# EAGLE design power_dist (EAGLE 9.6.0)
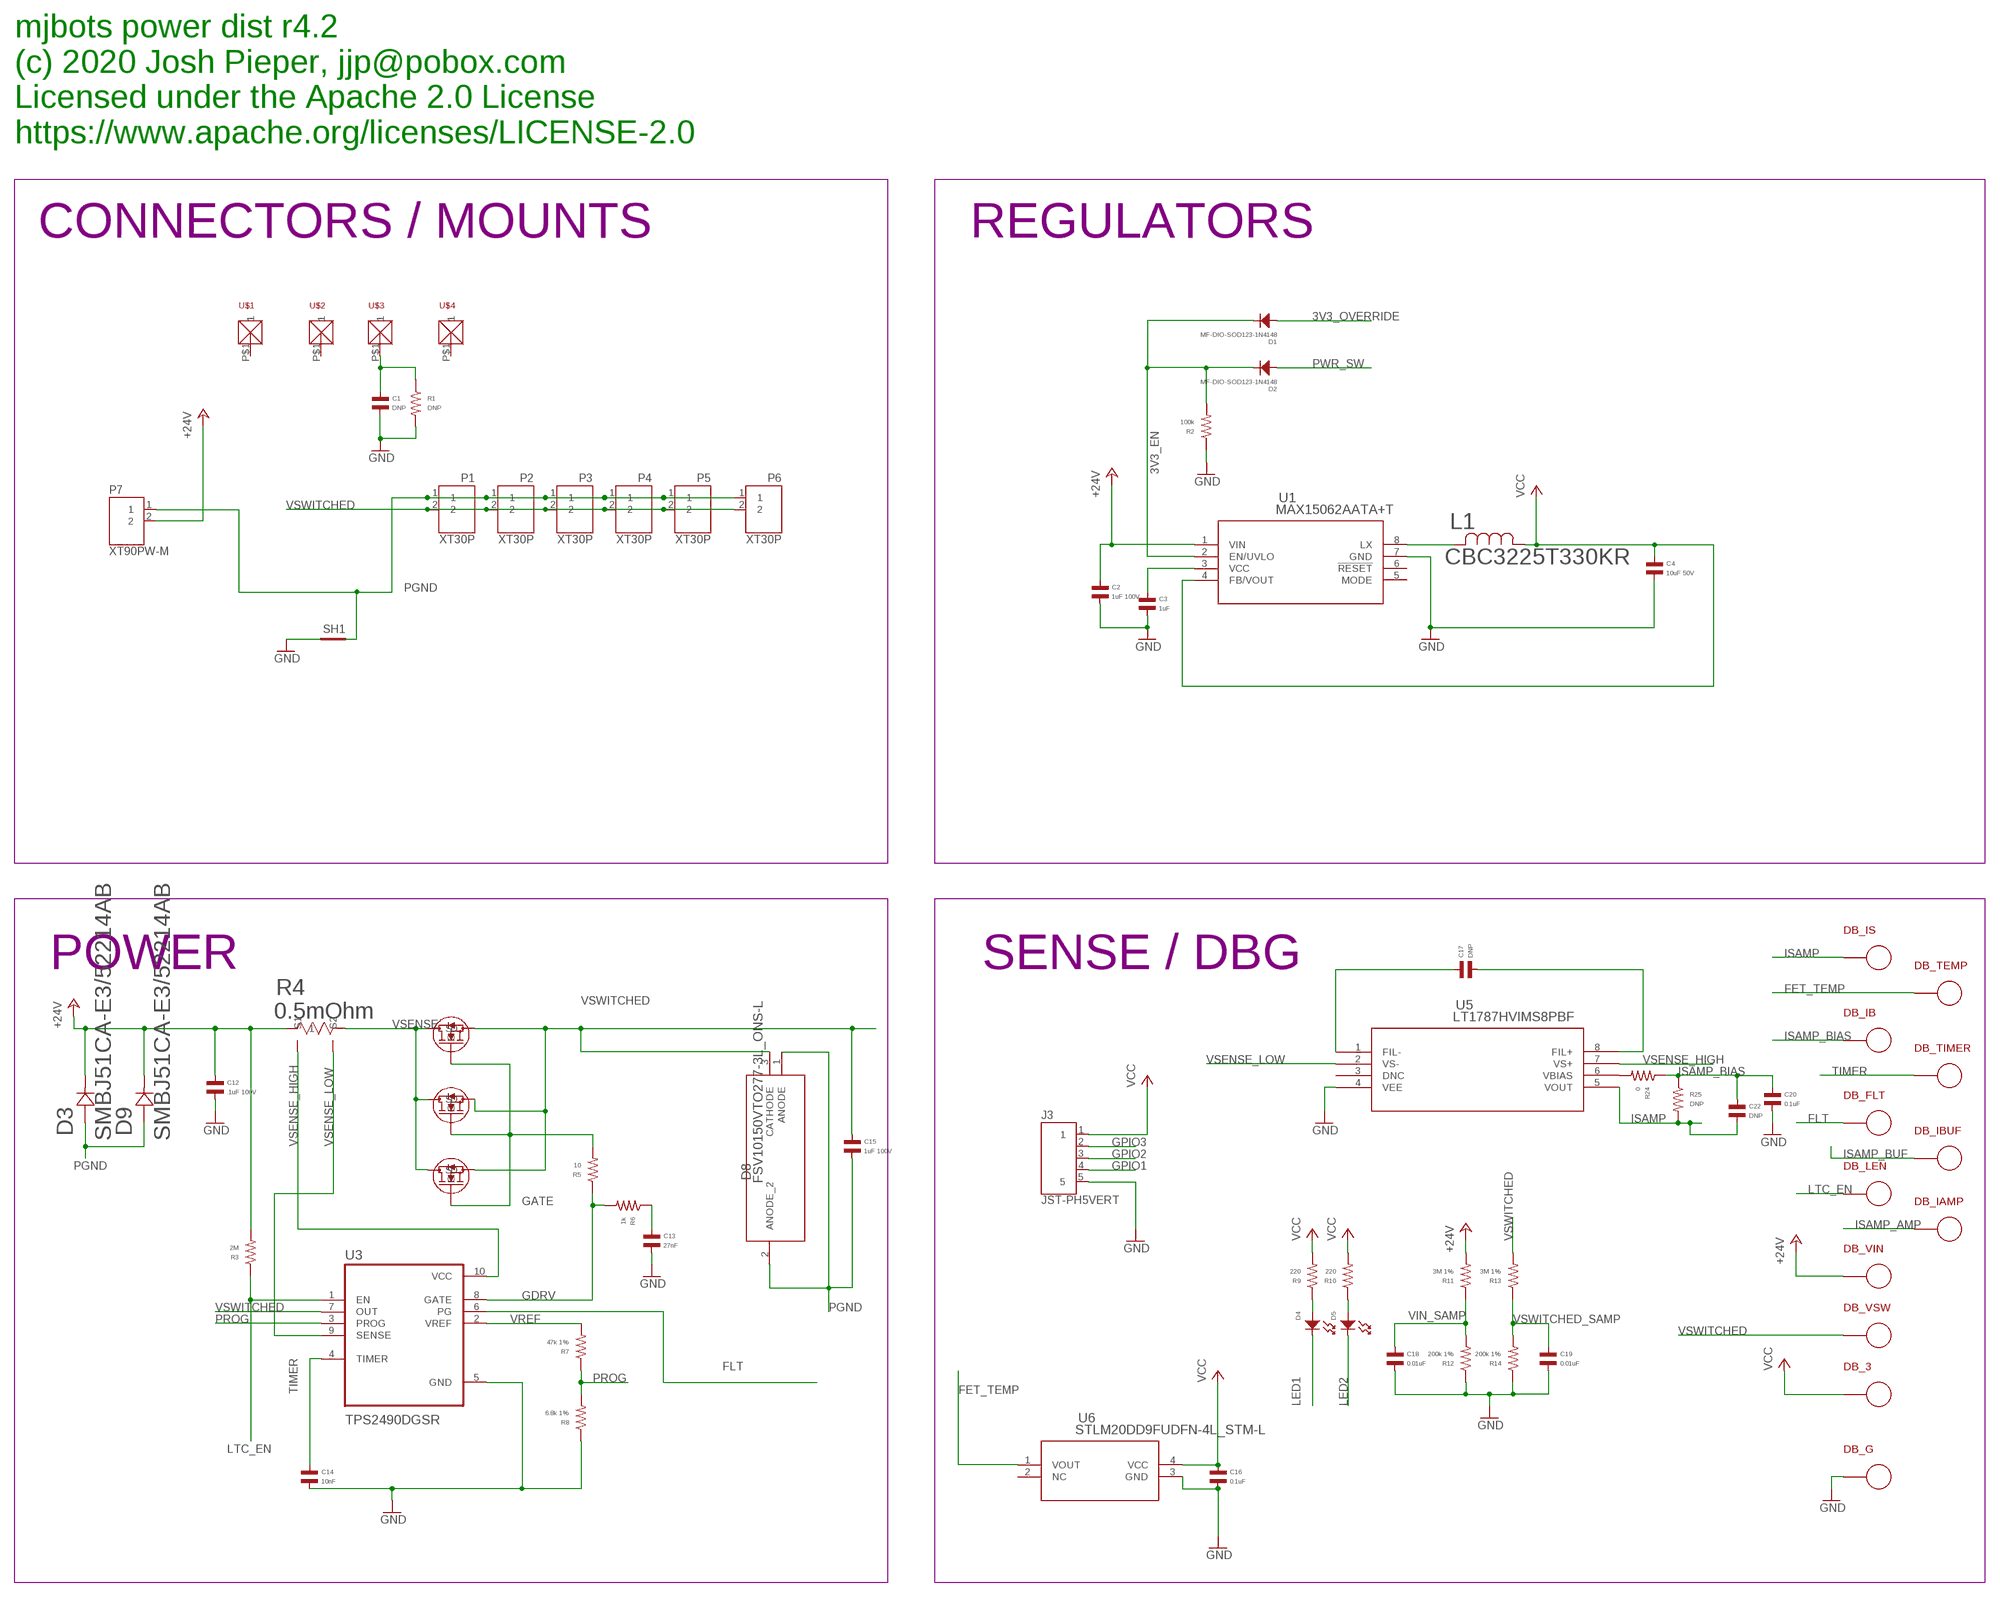
[diagram p0: schematic, sheet 1, part 1 of 2]
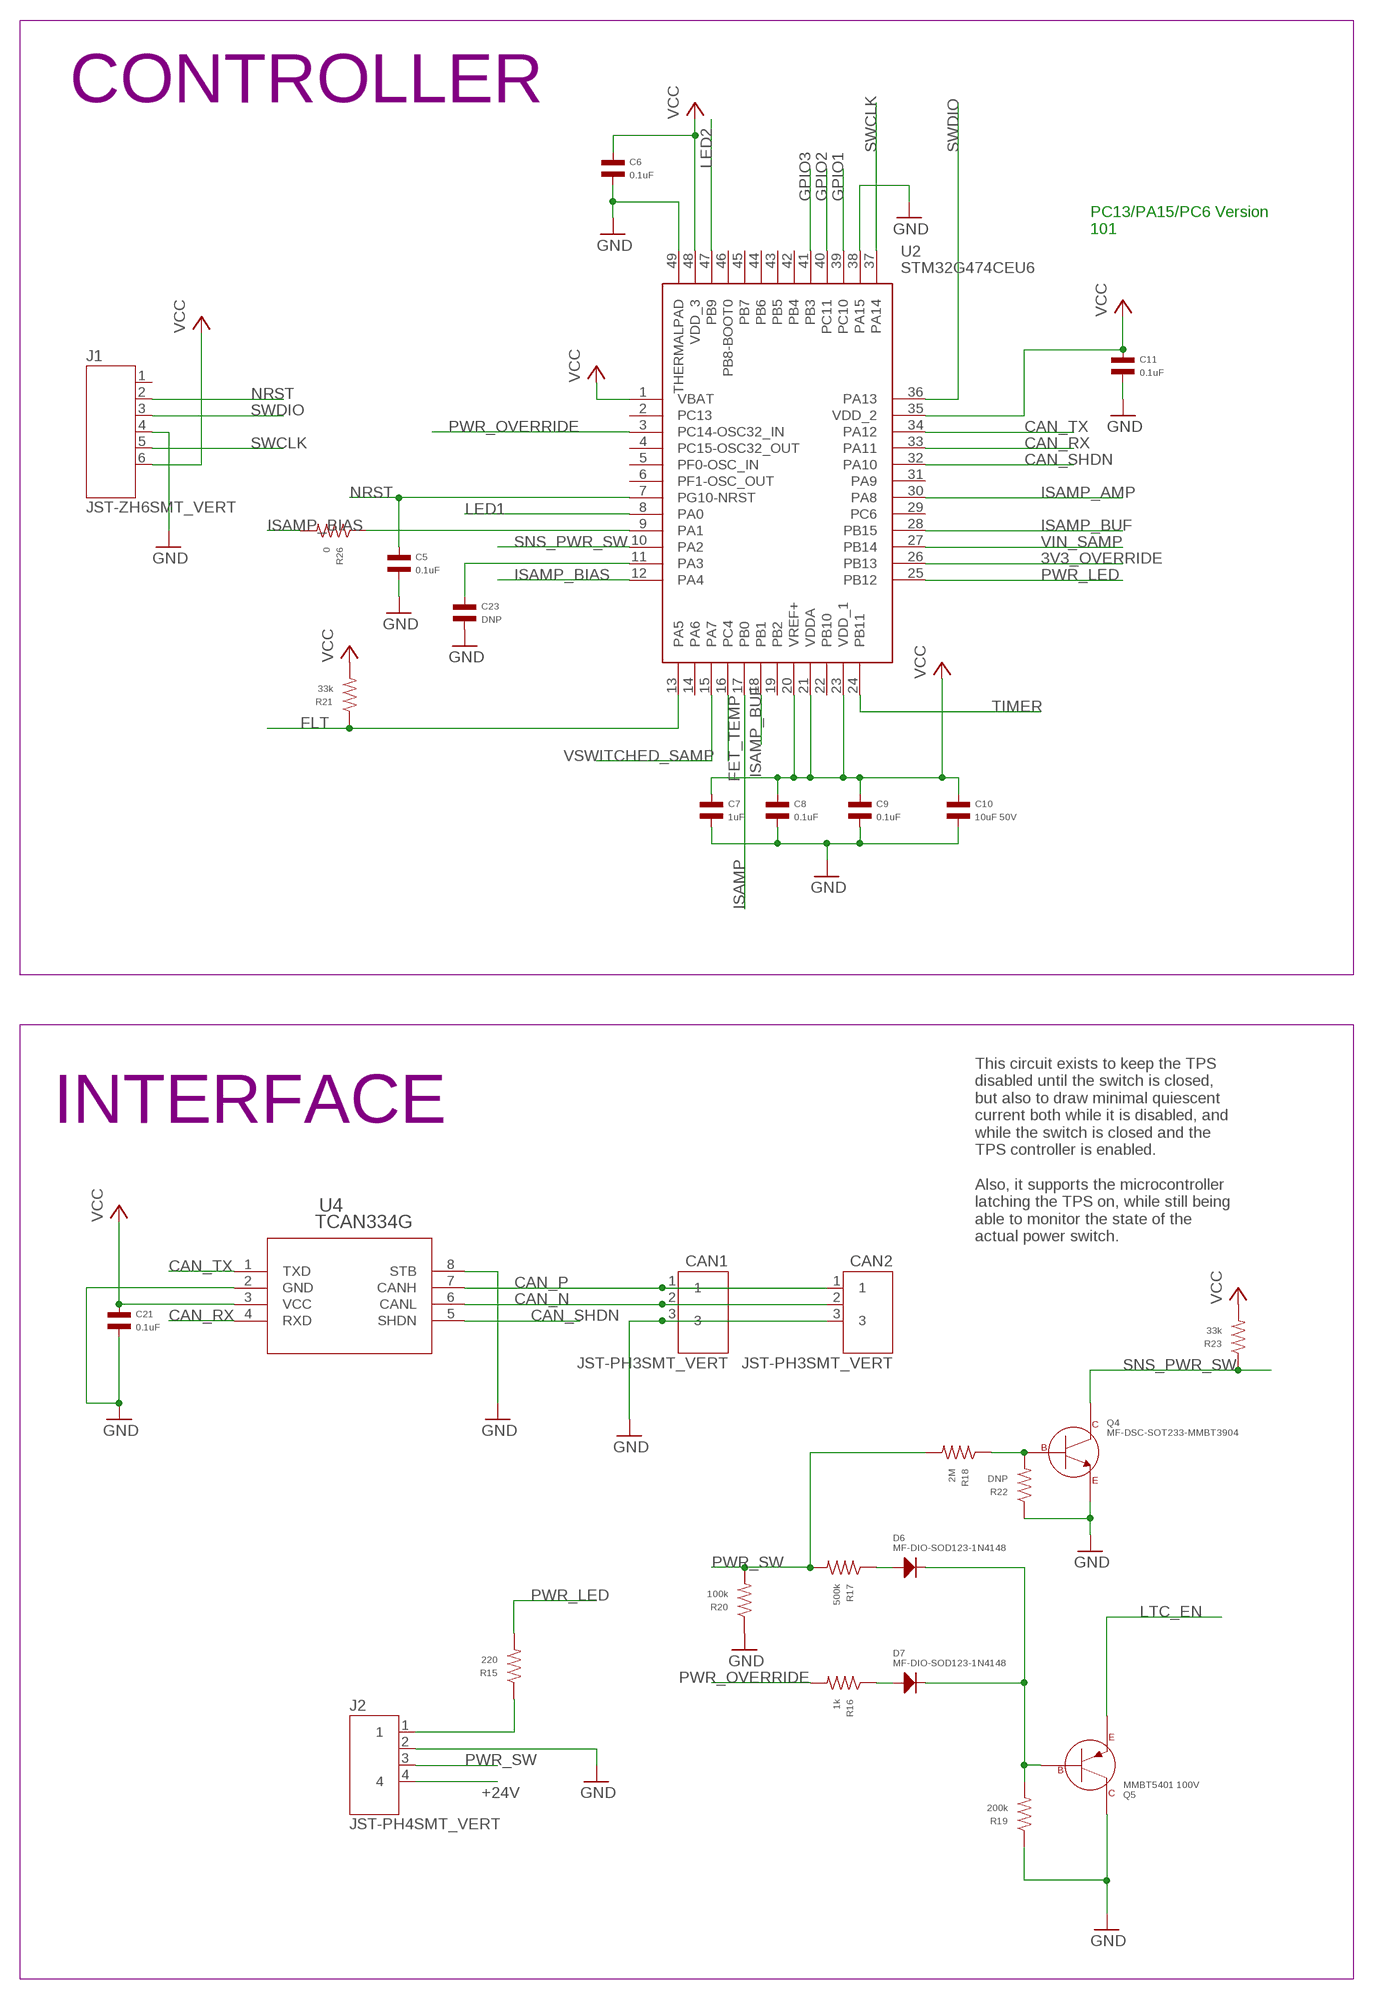
[diagram p1: schematic, sheet 1, part 2 of 2]

## Parts
C1  DNP  CAPACITOR_NP_0603  [C0603]
C2  1uF 100V  CAPACITOR_NP_0805  [C0805]
C3  1uF  CAPACITOR_NP_0603  [C0603]
C4  10uF 50V  CAPACITOR_NP_1206  [C1206]
C5  0.1uF  CAPACITOR_NP_0603  [C0603]
C6  0.1uF  CAPACITOR_NP_0603  [C0603]
C7  1uF  CAPACITOR_NP_0603  [C0603]
C8  0.1uF  CAPACITOR_NP_0603  [C0603]
C9  0.1uF  CAPACITOR_NP_0603  [C0603]
C10  10uF 50V  CAPACITOR_NP_1206  [C1206]
C11  0.1uF  CAPACITOR_NP_0603  [C0603]
C12  .1uF 100V  CAPACITOR_NP_0603  [C0603]
C13  27nF  CAPACITOR_NP_0603  [C0603]
C14  10nF  CAPACITOR_NP_0603  [C0603]
C15  1uF 100V  CAPACITOR_NP_0805  [C0805]
C16  0.1uF  CAPACITOR_NP_0603  [C0603]
C17  DNP  CAPACITOR_NP_0603  [C0603]
C18  0.01uF  CAPACITOR_NP_0603  [C0603]
C19  0.01uF  CAPACITOR_NP_0603  [C0603]
C20  0.1uF  CAPACITOR_NP_0603  [C0603]
C21  0.1uF  CAPACITOR_NP_0603  [C0603]
C22  DNP  CAPACITOR_NP_0603  [C0603]
C23  DNP  CAPACITOR_NP_0603  [C0603]
CAN1  JST-PH3SMT_VERT  [JST_B3B_PH-SM4-TB(LF)(SN)]
CAN2  JST-PH3SMT_VERT  [JST_B3B_PH-SM4-TB(LF)(SN)]
D1  MF-DIO-SOD123-1N4148  DIODES_1N4148_SOD-123  [SOD-123]
D2  MF-DIO-SOD123-1N4148  DIODES_1N4148_SOD-123  [SOD-123]
D3  SMBJ51CA-E3/52214AB  [DIODE_DO-214AB]
D4  LED_SINGLE-0603  [LED0603]
D5  LED_SINGLE-0603  [LED0603]
D6  MF-DIO-SOD123-1N4148  DIODES_1N4148_SOD-123  [SOD-123]
D7  MF-DIO-SOD123-1N4148  DIODES_1N4148_SOD-123  [SOD-123]
D8  FSV10150VTO277-3L_ONS-L  [TO277-3L_ONS-L]
D9  SMBJ51CA-E3/52214AB  [DIODE_DO-214AB]
DB_3  PAD24AWG_PAD  [24AWG_PAD]
DB_FLT  PAD24AWG_PAD  [24AWG_PAD]
DB_G  PAD24AWG_PAD  [24AWG_PAD]
DB_IAMP  PAD24AWG_PAD  [24AWG_PAD]
DB_IB  PAD24AWG_PAD  [24AWG_PAD]
DB_IBUF  PAD24AWG_PAD  [24AWG_PAD]
DB_IS  PAD24AWG_PAD  [24AWG_PAD]
DB_LEN  PAD24AWG_PAD  [24AWG_PAD]
DB_TEMP  PAD24AWG_PAD  [24AWG_PAD]
DB_TIMER  PAD24AWG_PAD  [24AWG_PAD]
DB_VIN  PAD24AWG_PAD  [24AWG_PAD]
DB_VSW  PAD24AWG_PAD  [24AWG_PAD]
J1  JST-ZH6SMT_VERT  [JST_B6B-ZR-SM4-TF(LF)(SN)]
J2  JST-PH4SMT_VERT  [JST_B4B_PH-SM4-TB(LF)(SN)]
J3  JST-PH5VERT  [JST_B5B_PH-SM4-TB(LF)(SN)]
L1  CBC3225T330KR  [IND_TAIYO_CBC3225_TAY]
P1  XT30P  [XT30P]
P2  XT30P  [XT30P]
P3  XT30P  [XT30P]
P4  XT30P  [XT30P]
P5  XT30P  [XT30P]
P6  XT30P  [XT30P]
P7  XT90PW-M  [XT90PW-M]
Q1  PSMN4R8-100BSEJ  [D2PAK_SOT404_NEX]
Q2  PSMN4R8-100BSEJ  [D2PAK_SOT404_NEX]
Q3  PSMN4R8-100BSEJ  [D2PAK_SOT404_NEX]
Q4  MF-DSC-SOT233-MMBT3904  NPN_BJTMMBT3904_SOT-23-3  [SOT-23-3]
Q5  MMBT5401 100V  PNP_BJT_MMBT3906_SOT-23-3  [SOT-23-3]
R1  DNP  RESISTOR_0603  [R0603]
R2  100k  RESISTOR_0603  [R0603]
R3  2M  RESISTOR_0603  [R0603]
R4  0.5mOhm  SENSE_RESISTOR2512  [SHUNT2512]
R5  10  RESISTOR_0603  [R0603]
R6  1k  RESISTOR_0603  [R0603]
R7  47k 1%  RESISTOR_0603  [R0603]
R8  6.8k 1%  RESISTOR_0603  [R0603]
R9  220  RESISTOR_0603  [R0603]
R10  220  RESISTOR_0603  [R0603]
R11  3M 1%  RESISTOR_0603  [R0603]
R12  200k 1%  RESISTOR_0603  [R0603]
R13  3M 1%  RESISTOR_0603  [R0603]
R14  200k 1%  RESISTOR_0603  [R0603]
R15  220  RESISTOR_0603  [R0603]
R16  1k  RESISTOR_0603  [R0603]
R17  500k  RESISTOR_0603  [R0603]
R18  2M  RESISTOR_0603  [R0603]
R19  200k  RESISTOR_0603  [R0603]
R20  100k  RESISTOR_0603  [R0603]
R21  33k  RESISTOR_0603  [R0603]
R22  DNP  RESISTOR_0603  [R0603]
R23  33k  RESISTOR_0603  [R0603]
R24  0  RESISTOR_0603  [R0603]
R25  DNP  RESISTOR_0603  [R0603]
R26  0  RESISTOR_0603  [R0603]
SH1  SHORTBIG  [SHORT_TOP-BIG]
U1  MAX15062AATA+T  [21-0487A_MXM]
U2  STM32G474CEU6  [QFN50P700X700X60-49N]
U3  TPS2490DGSR  [SOP50P490X110-10N]
U4  TCAN334G  [SOIC8]
U5  LT1787HVIMS8PBF  [MSOP-8_MS]
U6  STLM20DD9FUDFN-4L_STM-L  [UDFN-4L_STM-L]
U$1  MOUNT  [M2.5MOUNT]
U$2  MOUNT  [M2.5MOUNT]
U$3  MOUNT  [M2.5MOUNT]
U$4  MOUNT  [M2.5MOUNT]

## Nets
3V3_EN: D1.CATHODE D2.CATHODE R2.P$2 U1.2(EN/UVLO)
3V3_OVERRIDE: D1.ANODE U2.26(PB13)
+24V: C2.P$1 C12.P$1 D3.P$1 D9.P$1 DB_VIN.P$1 J2.4 P7.2 R3.P$2 R4.1 R11.P$2 U1.1(VIN)
CAN_N: CAN1.2 CAN2.2 U4.6(CANL)
CAN_P: CAN1.1 CAN2.1 U4.7(CANH)
CAN_RX: U2.33(PA11) U4.4(RXD)
CAN_SHDN: U2.32(PA10) U4.5(SHDN)
CAN_TX: U2.34(PA12) U4.1(TXD)
FET_TEMP: DB_TEMP.P$1 U2.16(PC4) U6.1(VOUT)
FLT: DB_FLT.P$1 R21.P$1 U2.13(PA5) U3.6(PG)
GATE: Q1.1(G) Q2.1(G) Q3.1(G) R5.P$2
GDRV: R5.P$1 R6.P$2 U3.8(GATE)
GND: C1.P$2 C2.P$2 C3.P$2 C4.P$2 C5.P$2 C6.P$2 C7.P$2 C8.P$2 C9.P$2 C10.P$2 C11.P$2 C12.P$2 C13.P$2 C14.P$2 C16.P$2 C18.P$2 C19.P$2 C20.P$2 C21.P$2 C23.P$2 CAN1.3 CAN2.3 DB_G.P$1 J1.4 J2.2 J3.5 Q4.P$2(EMITTER) Q5.P$3(COLLECTOR) R1.P$2 R2.P$1 R8.P$1 R12.P$1 R14.P$1 R19.P$1 R20.P$1 R22.P$1 SH1.1 U1.7(GND) U2.38(PA15) U2.49(THERMALPAD) U3.5(GND) U4.2(GND) U4.8(STB) U5.4(VEE) U6.3(GND)
GPIO1: J3.4 U2.39(PC10)
GPIO2: J3.3 U2.40(PC11)
GPIO3: J3.2 U2.41(PB3)
ISAMP: C22.P$2 DB_IS.P$1 R25.P$2 U2.17(PB0) U5.5(VOUT)
ISAMP_AMP: DB_IAMP.P$1 U2.30(PA8)
ISAMP_BIAS: C20.P$1 C22.P$1 DB_IB.P$1 R24.P$1 R25.P$1 R26.P$2 U2.12(PA4)
ISAMP_BUF: DB_IBUF.P$1 U2.18(PB1) U2.28(PB15)
LED1: D4.CATHODE U2.8(PA0)
LED2: D5.CATHODE U2.47(PB9)
LTC_EN: DB_LEN.P$1 Q5.P$2(EMITTER) R3.P$1 U3.1(EN)
N$1: L1.2 U1.8(LX)
N$2: J2.1 R15.P$1
N$3: R24.P$2 U5.6(VBIAS)
N$4: C3.P$1 U1.3(VCC)
N$5: C23.P$1 U2.11(PA3)
N$6: C17.P$1 U5.1(FIL-)
N$7: C17.P$2 U5.8(FIL+)
N$8: D4.ANODE R9.P$1
N$9: C13.P$1 R6.P$1
N$10: R26.P$1 U2.9(PA1)
N$11: Q4.P$1(BASE) R18.P$1 R22.P$2
N$13: D6.CATHODE D7.CATHODE Q5.P$1(BASE) R19.P$2
N$14: D5.ANODE R10.P$1
N$15: C1.P$1 R1.P$1 U$3.P$1
N$17: D6.ANODE R17.P$1
N$18: D7.ANODE R16.P$1
NRST: C5.P$1 J1.2 U2.7(PG10-NRST)
PGND: C15.P$2 D3.P$2 D8.1(ANODE) D8.2(ANODE_2) D9.P$2 P1.1 P2.1 P3.1 P4.1 P5.1 P6.1 P7.1 SH1.2
PROG: R7.P$1 R8.P$2 U3.3(PROG)
PWR_LED: R15.P$2 U2.25(PB12)
PWR_OVERRIDE: R16.P$2 U2.3(PC14-OSC32_IN)
PWR_SW: D2.ANODE J2.3 R17.P$2 R18.P$2 R20.P$2
SNS_PWR_SW: Q4.P$3(COLLECTOR) R23.P$1 U2.10(PA2)
SWCLK: J1.5 U2.37(PA14)
SWDIO: J1.3 U2.36(PA13)
TIMER: C14.P$1 DB_TIMER.P$1 U2.24(PB11) U3.4(TIMER)
VCC [power]: C4.P$1 C6.P$1 C7.P$1 C8.P$1 C9.P$1 C10.P$1 C11.P$1 C16.P$1 C21.P$1 DB_3.P$1 J1.6 J3.1 L1.1 R9.P$2 R10.P$2 R21.P$2 R23.P$2 U1.4(FB/VOUT) U2.1(VBAT) U2.20(VREF+) U2.21(VDDA) U2.23(VDD_1) U2.35(VDD_2) U2.48(VDD_3) U4.3(VCC) U6.4(VCC)
VIN_SAMP: C18.P$1 R11.P$1 R12.P$2 U2.27(PB14)
VREF: R7.P$2 U3.2(VREF)
VSENSE: Q1.2(D) Q2.2(D) Q3.2(D) R4.2
VSENSE_HIGH: R4.3(S1) U3.10(VCC) U5.7(VS+)
VSENSE_LOW: R4.4(S2) U3.9(SENSE) U5.2(VS-)
VSWITCHED: C15.P$1 D8.3(CATHODE) DB_VSW.P$1 P1.2 P2.2 P3.2 P4.2 P5.2 P6.2 Q1.3(S) Q2.3(S) Q3.3(S) R13.P$2 U3.7(OUT)
VSWITCHED_SAMP: C19.P$1 R13.P$1 R14.P$2 U2.15(PA7)
Unconnected: J1.1 U1.5(MODE) U1.6(!RESET) U2.2(PC13) U2.4(PC15-OSC32_OUT) U2.5(PF0-OSC_IN) U2.6(PF1-OSC_OUT) U2.14(PA6) U2.19(PB2) U2.22(PB10) U2.29(PC6) U2.31(PA9) U2.42(PB4) U2.43(PB5) U2.44(PB6) U2.45(PB7) U2.46(PB8-BOOT0) U5.3(DNC) U6.2(NC) U$1.P$1 U$2.P$1 U$4.P$1

## Notes on the sheet
- mjbots power dist r4.2
  (c) 2020 Josh Pieper, jjp@pobox.com
  Licensed under the Apache 2.0 License
  https://www.apache.org/licenses/LICENSE-2.0
- CONNECTORS / MOUNTS | REGULATORS | CONTROLLER
- PC13/PA15/PC6 Version
  101
- This circuit exists to keep the TPS
  disabled until the switch is closed, 
  but also to draw minimal quiescent 
  current both while it is disabled, and 
  while the switch is closed and the 
  TPS controller is enabled.
  
  Also, it supports the microcontroller
  latching the TPS on, while still being
  able to monitor the state of the
  actual power switch.
- POWER | SENSE / DBG | INTERFACE

## Library data of the parts
C1 C17 = mfpassives:CAPACITOR_NP: Library: MF_Passives Description: Device for Non-Polarized Capacitors. Manufacture part number (MPN) can be added via Attributes. Check https://factory.macrofab.com/parts for the house parts list.; POPULATE: 0
C2 C15 = mfpassives:CAPACITOR_NP: Library: MF_Passives Description: Device for Non-Polarized Capacitors. Manufacture part number (MPN) can be added via Attributes. Check https://factory.macrofab.com/parts for the house parts list.; MF: MURATA; MPN: GCM21BC72A105KE36L; POPULATE: 1
C3 C7 = mfpassives:CAPACITOR_NP: Library: MF_Passives Description: Device for Non-Polarized Capacitors. Manufacture part number (MPN) can be added via Attributes. Check https://factory.macrofab.com/parts for the house parts list.; HOUSEPART: 1; MPN: MF-CAP-0603-1uF; POPULATE: 1
C4 C10 = mfpassives:CAPACITOR_NP: Library: MF_Passives Description: Device for Non-Polarized Capacitors. Manufacture part number (MPN) can be added via Attributes. Check https://factory.macrofab.com/parts for the house parts list.; MF: TDK; MPN: C3216X7R1H106K160AE; POPULATE: 1
C5 C6 C8 C9 C11 C12 C14 C16 C20 C21 = mfpassives:CAPACITOR_NP: Library: MF_Passives Description: Device for Non-Polarized Capacitors. Manufacture part number (MPN) can be added via Attributes. Check https://factory.macrofab.com/parts for the house parts list.; HOUSEPART: 1; MPN: MF-CAP-0603-0.1uF; POPULATE: 1
C13 = mfpassives:CAPACITOR_NP: Library: MF_Passives Description: Device for Non-Polarized Capacitors. Manufacture part number (MPN) can be added via Attributes. Check https://factory.macrofab.com/parts for the house parts list.; HOUSEPART: 1; POPULATE: 1
C18 C19 = mfpassives:CAPACITOR_NP: Library: MF_Passives Description: Device for Non-Polarized Capacitors. Manufacture part number (MPN) can be added via Attributes. Check https://factory.macrofab.com/parts for the house parts list.; HOUSEPART: 1; MPN: MF-CAP-0603-0.01uF; POPULATE: 1
C22 C23 = mfpassives:CAPACITOR_NP: Library: MF_Passives Description: Device for Non-Polarized Capacitors. Manufacture part number (MPN) can be added via Attributes. Check https://factory.macrofab.com/parts for the house parts list.; HOUSEPART: 1; POPULATE: 0
CAN1 CAN2 = precharge:JST-PH3; MF: JST; MPN: B3B-PH-SM4-TB(LF)(SN); POPULATE: 1
D1 D2 D6 D7 = mfdiscretesemi:DIODES: Library: MF_Discrete_Semiconductor Description: Device for Single Packaged Diodes.; HOUSEPART: YES; MPN: MF-DIO-SOD123-1N4148; POPULATE: 1; URL: https://factory.macrofab.com/part/MF-DIO-SOD123-1N4148
D3 D9 = power_dist:SMBJ51CA-E3/52; MPN: SMC5K51A-M3/I; POPULATE: 1
D4 D5 = mfleds:LED_SINGLE: Library: MF_LEDs Description: Device for Single LED Packages. Manufacture part number (MFG#) can be added via Attributes.; HOUSEPART: 1; MPN: MF-LED-0603-RED; POPULATE: 1
D8 = power_dist:FSV10150V; BUILT_BY: EMA_Jessica; COPYRIGHT: Copyright (C) 2018 Accelerated Designs. All rights reserved; MANUFACTURER_PART_NUMBER: FSV10150V; MPN: FSV10150V; POPULATE: 1; SOURCELIBRARY: ON_Semiconductor_2019-12-30; VENDOR: ON Semiconductor
DB_3 DB_FLT DB_G DB_IAMP DB_IB DB_IBUF DB_IS DB_LEN DB_TEMP DB_TIMER DB_VIN DB_VSW = precharge:PAD; POPULATE: 0
J1 = precharge:JST-ZH6; MF: JST; MPN: B6B-ZR-SM4-TF(LF)(SN); POPULATE: 1
J2 = precharge:JST-PH4; MF: JST; MPN: B4B-PH-SM4-TB(LF)(SN); POPULATE: 1
J3 = power_dist:JST-PH5; MF: JST; MPN: B5B-PH-SM4-TB(LF)(SN); POPULATE: 1
L1 = power_dist:CBC3225T330KR; BUILT_BY: EMA_UL_Team; MANUFACTURER_PART_NUMBER: CBC3225T330KR; MPN: CBC3225T330KR; POPULATE: 1; SOURCELIBRARY: TaiyoYuden_2011-01-01_IND_CB; VENDOR: TAIYO YUDEN
P1-P6 = precharge:XT30; MF: AMASS; MPN: XT30UPB-F; POPULATE: 1
P7 = power_dist:XT90; POPULATE: 0
Q1-Q3 = power_dist:PSMN4R8-100BSEJ; BUILT_BY: EMA_Cory; COPYRIGHT: Copyright (C) 2018 Accelerated Designs. All rights reserved; DATASHEET: https://assets.nexperia.com/documents/data-sheet/PSMN4R8-100BSE.pdf; MANUFACTURER_PART_NUMBER: PSMN3R7-100BSE; MPN: PSMN3R7-100BSE; POPULATE: 1; SOURCELIBRARY: Nexperia_2020-02-27; VENDOR: Nexperia
Q4 = mfdiscretesemi:NPN_BJT: Library: MF_Discrete_Semiconductor Description: Device for Single NPN BJT Transistors. Manufacture part number (MFG#) can be added via Attributes.; HOUSEPART: YES; MPN: MF-DSC-SOT233-MMBT3904; POPULATE: 1; URL: https://factory.macrofab.com/part/MF-DSC-SOT233-MMBT3904
Q5 = mfdiscretesemi:PNP_BJT: Library: MF_Discrete_Semiconductor Description: Device for Single PNP BJT Transistors. Manufacture part number (MFG#) can be added via Attributes.; MF: DIODES; MPN: MMBT5401-7-F; POPULATE: 1; VALUE: MF-DSC-SOT233-MMBT3906
R1 = mfpassives:RESISTOR: Library: MF_Passives Description: Device for Resistors. Manufacture part number (MPN), Voltage, Tolerance, and Wattage Rating can be added via Attributes. Check https://factory.macrofab.com/parts for the house parts list.; POPULATE: 0
R2 R3 R5-R8 R11-R14 R16-R26 = mfpassives:RESISTOR: Library: MF_Passives Description: Device for Resistors. Manufacture part number (MPN), Voltage, Tolerance, and Wattage Rating can be added via Attributes. Check https://factory.macrofab.com/parts for the house parts list.; HOUSEPART: 1; POPULATE: 1
R4 = power_dist:SENSE_RESISTOR; MF: VISHAY DALE; MPN: WSLF2512L5000FEA; POPULATE: 1
R9 R10 R15 = mfpassives:RESISTOR: Library: MF_Passives Description: Device for Resistors. Manufacture part number (MPN), Voltage, Tolerance, and Wattage Rating can be added via Attributes. Check https://factory.macrofab.com/parts for the house parts list.; HOUSEPART: 1; MPN: MF-RES-0603-220; POPULATE: 1
SH1 = shorts:SHORT: Short between two nets; POPULATE: 0
U1 = power_dist:MAX15062AATA+T; BUILT_BY: EMA_Jessica; COPYRIGHT: Copyright (C) 2018 Accelerated Designs. All rights reserved; MANUFACTURER_PART_NUMBER: MAX15062AATA+T; MPN: MAX15062AATA+T; POPULATE: 1; REVISION: 1; SOURCELIBRARY: Maxim_DP_2018-06-12; VENDOR: Maxim Integrated Products
U2 = precharge:STM32G474CEU6: STMICROELECTRONICS - STM32G474CEU6 - MCU, 32BIT, 170MHZ, UFQFPN-48 Source: Datasheet <https://componentsearchengine.com/Datasheets/1/STM32G474CEU6.pdf>; DESCRIPTION: STMICROELECTRONICS - STM32G474CEU6 - MCU, 32BIT, 170MHZ, UFQFPN-48; HEIGHT: 0.6mm; MANUFACTURER_NAME: STMicroelectronics; MANUFACTURER_PART_NUMBER: STM32G474CEU6; MF: ST; MOUSER_PART_NUMBER: 511-STM32G474CEU6; MOUSER_PRICE-STOCK: https://www.mouser.com/Search/Refine.aspx?Keyword=511-STM32G474CEU6; MPN: STM32G474CEU6; POPULATE: 1
U3 = TPS2490DGSR:TPS2490DGSR; DESCRIPTION: 9-V to 80-V hot swap controller with power limiting and latch off 10-VSSOP -40 to 85; DIGI-KEY_PART_NUMBER: 296-26924-1-ND; MF: Texas Instruments; MP: TPS2490DGSR; PACKAGE: VSSOP-10 Texas Instruments; PURCHASE-URL: https://pricing.snapeda.com/search/part/TPS2490DGSR/?ref=eda
U4 = precharge:TCAN334G; MF: TI; MPN: TCAN334GDR; POPULATE: 1
U5 = LT1787HVIMS8PBF:LT1787HVIMS8PBF; DESCRIPTION: Current Sense Amplifier 1 Circuit 8-MSOP; DIGI-KEY_PART_NUMBER: LT1787HVIMS8#PBF-ND; MF: Linear Technology; MP: LT1787HVIMS8#PBF; PACKAGE: MSOP-8 Linear Technology; PURCHASE-URL: https://pricing.snapeda.com/search/part/LT1787HVIMS8#PBF/?ref=eda
U6 = power_dist:STLM20DD9F; BUILT_BY: EMA_Jessica; COPYRIGHT: Copyright (C) 2018 Accelerated Designs. All rights reserved; MANUFACTURER_PART_NUMBER: STLM20DD9F; MPN: STLM20DD9F; POPULATE: 1; SOURCELIBRARY: Update_to_database_2020-11-24; VENDOR: STMicroelectronics
U$1-U$4 = power_dist:MOUNT; POPULATE: 0

## Net classes
1 power: width 0.254 mm

## Board
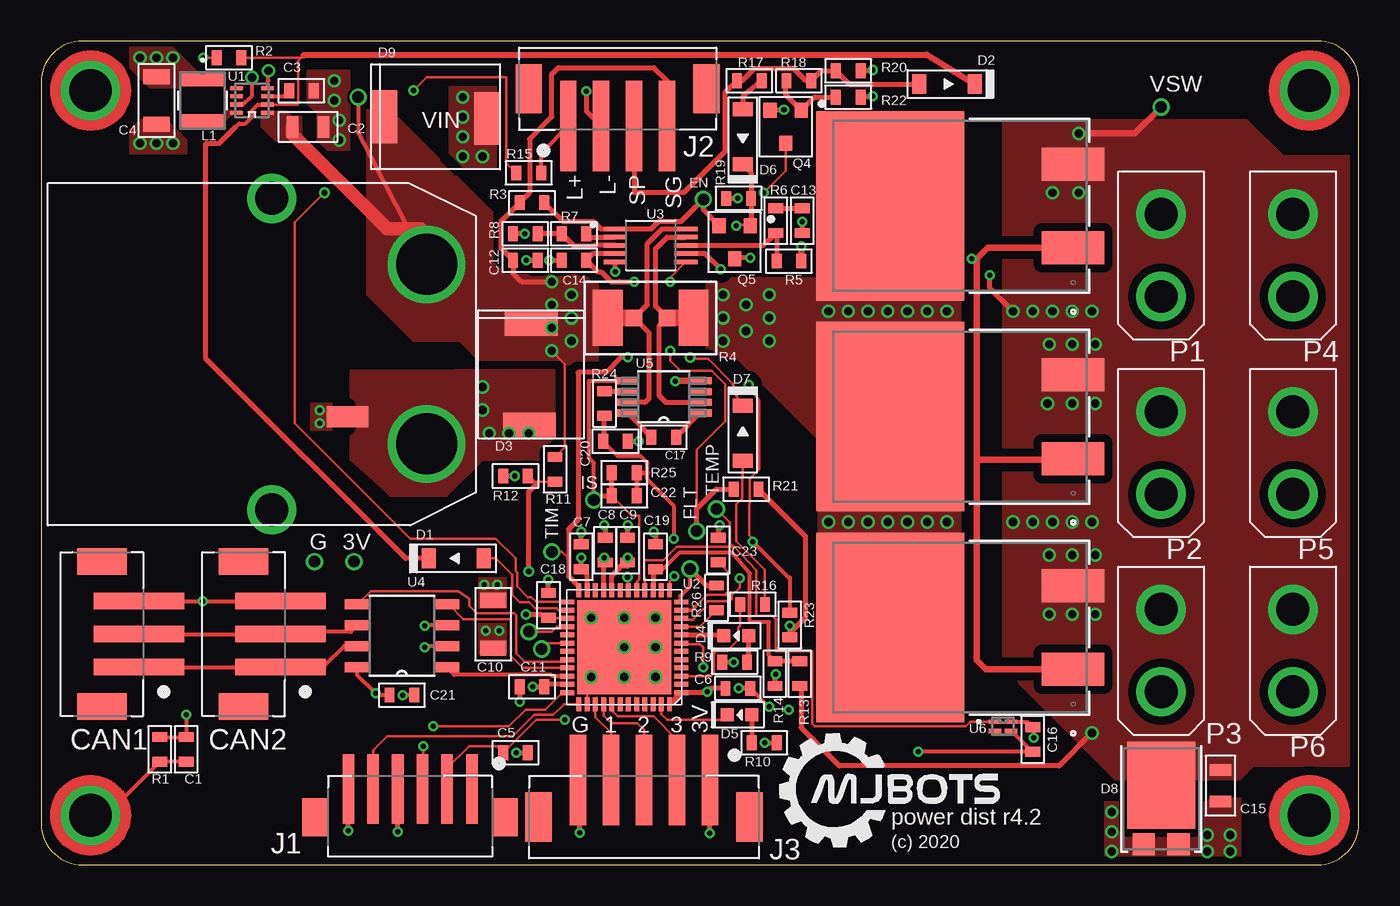
[diagram p2: board, top side]
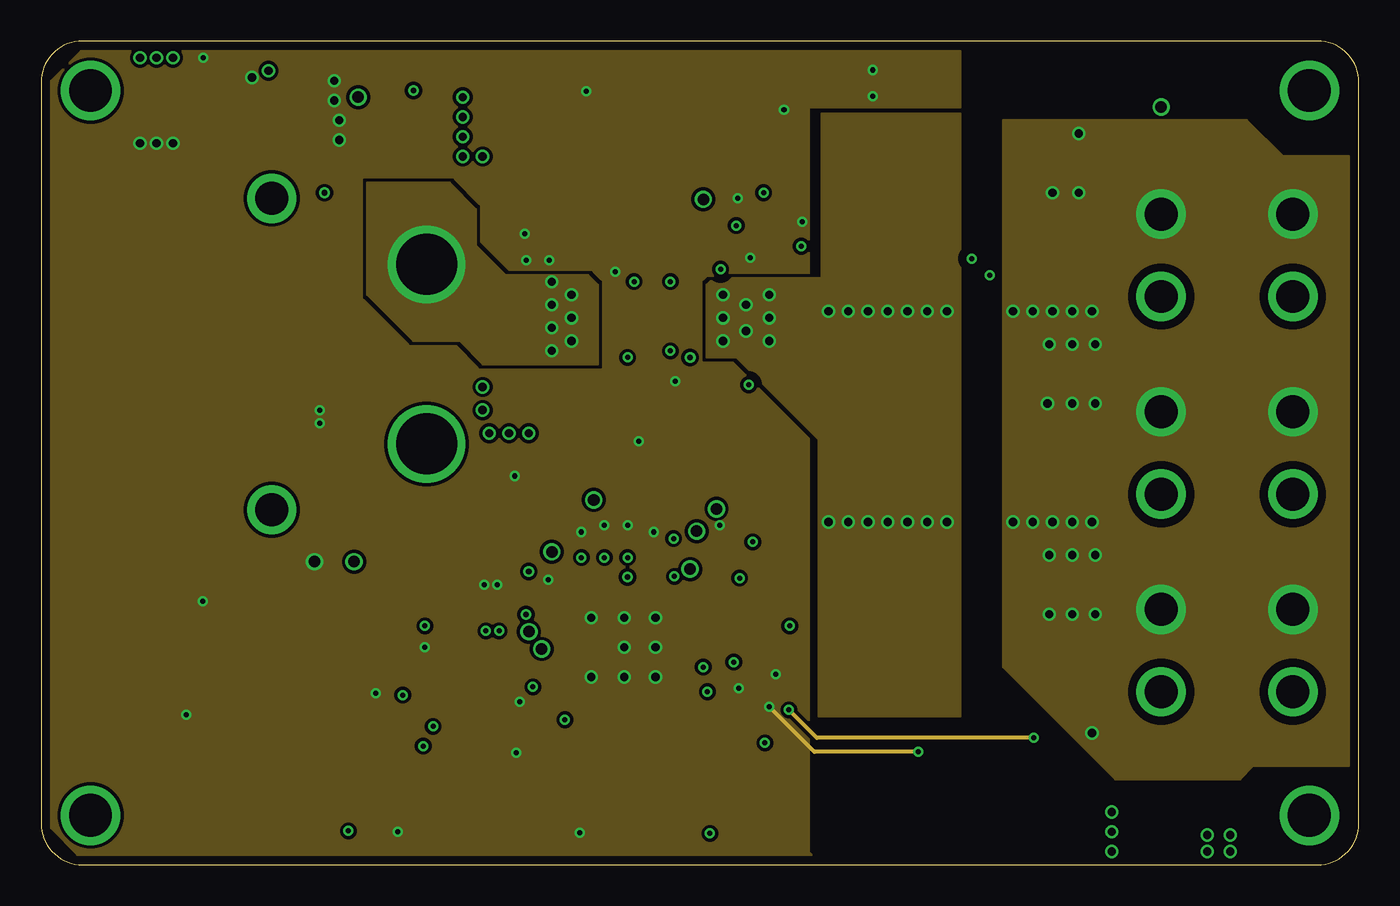
[diagram p3: board, inner layer Route2]
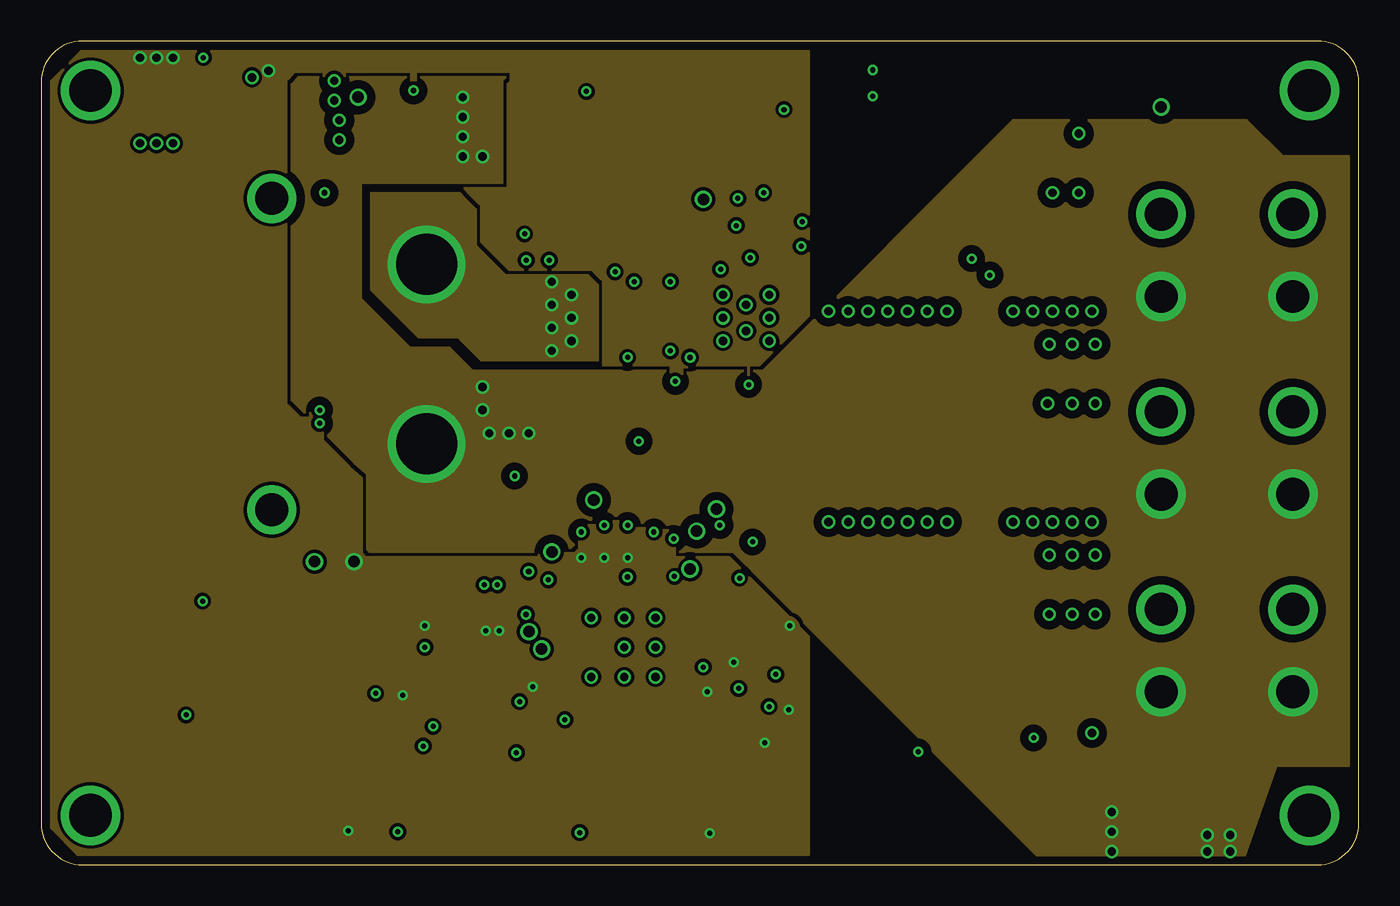
[diagram p4: board, inner layer Route15]
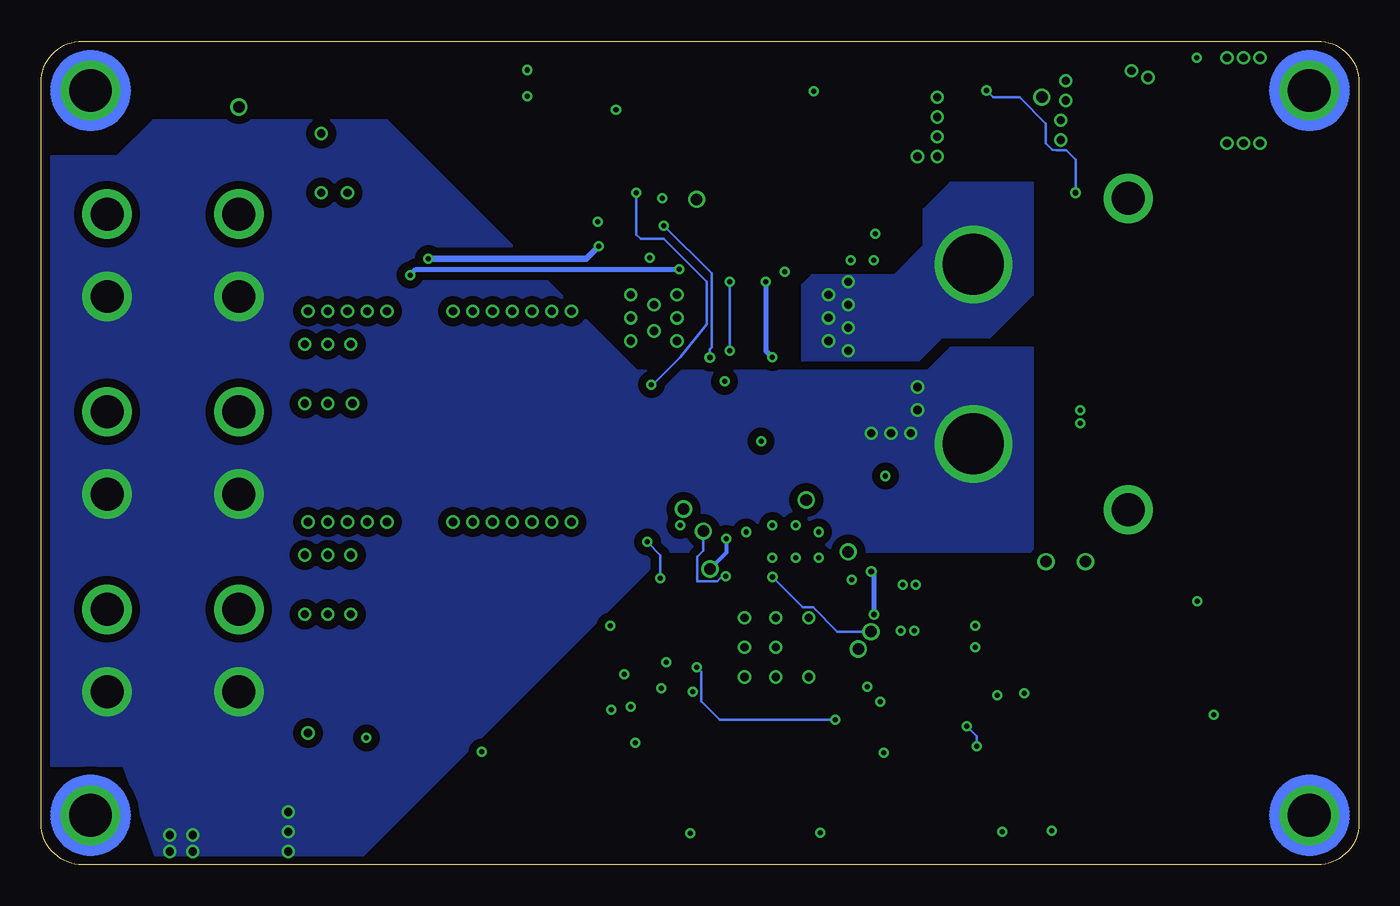
[diagram p5: board, bottom side, seen from below]

Size 80 x 50 mm. Coordinates in mm from the lower left corner, seen from the top.
Outline: 0,47.5 0,2.5 arc90 2.5,0 77.5,0 arc90 80,2.5 80,47.5 arc90 77.5,50 2.5,50 arc90 0,47.5
Copper layers (1*2*15*16): Top 0.035mm / dielectric 0.23mm / Route2 0.035mm / dielectric 0.93mm / Route15 0.035mm / dielectric 0.23mm / Bottom 0.035mm
Design rules "MF_Standard_4_Layer *": minimum track width 6mil, minimum drill 12mil, track to track 6mil, track to pad 6mil, pad to pad 6mil, via to via 6mil, smd to smd 0mil, copper to edge 10mil, drill to drill 10mil, minimum pad ring 6mil, minimum via ring 6mil, stop-mask expansion 2mil, vias tented up to drill 25mil, thermal gap 10mil

### Footprints (pad centres in the part's own frame; a part is rotated, then mirrored left to right if it is on the bottom)
C0603 = smd 0.6 x 0.9: P$1 -0.75,0; P$2 0.75,0
C0805 = smd 0.7 x 1.3: P$1 -0.95,0; P$2 0.95,0
C1206 = smd 0.9 x 1.6: P$1 -1.45,0; P$2 1.45,0
JST_B3B_PH-SM4-TB(LF)(SN) = smd 1 x 5.5: 1 -2,-2.54; 2 0,-2.54; 3 2,-2.54 | smd 1.6 x 3: P1 -4.4,-0.29; P2 4.4,-0.29
SOD-123 = smd 0.85 x 1.2: ANODE 1.675,0; CATHODE -1.675,0
DIODE_DO-214AB = smd 1.52 x 3.2: P$1 -3.105,0; P$2 3.105,-0.1
LED0603 = smd 0.8 x 0.8: ANODE 0.75,0; CATHODE -0.75,0
TO277-3L_ONS-L = smd 1.346 x 1.346: 1 1.05,-2.756; 2 -1.05,-2.756 | smd 4.14 x 5.309: 3 0,0.826
24AWG_PAD = drill 0.7: P$1 0,0
JST_B6B-ZR-SM4-TF(LF)(SN) = smd 0.7 x 4.2: 1 -3.75,-2; 2 -2.25,-2; 3 -0.75,-2; 4 0.75,-2; 5 2.25,-2; 6 3.75,-2 | smd 1.5 x 2.3: P1 -5.8,-0.29; P2 5.8,-0.29
JST_B4B_PH-SM4-TB(LF)(SN) = smd 1 x 5.5: 1 -3,-2.54; 2 -1,-2.54; 3 1,-2.54; 4 3,-2.54 | smd 1.6 x 3: P1 -5.4,-0.29; P2 5.4,-0.29
JST_B5B_PH-SM4-TB(LF)(SN) = smd 1 x 5.5: 1 -4,-2.54; 2 -2,-2.54; 3 0,-2.54; 4 2,-2.54; 5 4,-2.54 | smd 1.6 x 3: P1 -6.4,-0.29; P2 6.4,-0.29
IND_TAIYO_CBC3225_TAY = smd 0.851 x 2.692: 1 -1.276,0; 2 1.276,0
XT30P = drill 2: 1 -2.5,0; 2 2.5,0
XT90PW-M = drill 3.7: 1 -5.45,0; 2 5.45,0 | drill 2: S1 -9.45,9.4; S2 9.45,9.4
D2PAK_SOT404_NEX = smd 2.007 x 3.81: 1 -2.54,-6.845; 3 2.54,-6.845 | smd 11.506 x 8.992: 2 0,4.255
SOT-23-3 = smd 0.9 x 0.8: P$1 -1,0.95; P$2 -1,-0.95; P$3 1,0
R0603 = smd 0.6 x 0.9: P$1 -0.75,0; P$2 0.75,0
SHUNT2512 = smd 1.8 x 3.4: 1 -2.6,0; 2 2.6,0 | smd 1 x 1: 3 -1,0; 4 1,0
SHORT_TOP-BIG = smd 1.27 x 1.27: 1 0.635,0; 2 -0.635,0
21-0487A_MXM = smd 0.762 x 0.254: 1 -0.953,0.75; 2 -0.953,0.25; 3 -0.953,-0.25; 4 -0.953,-0.75; 5 0.953,-0.75; 6 0.953,-0.25; 7 0.953,0.25; 8 0.953,0.75
QFN50P700X700X60-49N = smd 0.85 x 0.3: 1 -3.45,2.75; 2 -3.45,2.25; 3 -3.45,1.75; 4 -3.45,1.25; 5 -3.45,0.75; 6 -3.45,0.25; 7 -3.45,-0.25; 8 -3.45,-0.75; 9 -3.45,-1.25; 10 -3.45,-1.75; 11 -3.45,-2.25; 12 -3.45,-2.75; 25 3.45,-2.75; 26 3.45,-2.25; 27 3.45,-1.75; 28 3.45,-1.25; 29 3.45,-0.75; 30 3.45,-0.25; 31 3.45,0.25; 32 3.45,0.75; 33 3.45,1.25; 34 3.45,1.75; 35 3.45,2.25; 36 3.45,2.75 | smd 0.3 x 0.85: 13 -2.75,-3.45; 14 -2.25,-3.45; 15 -1.75,-3.45; 16 -1.25,-3.45; 17 -0.75,-3.45; 18 -0.25,-3.45; 19 0.25,-3.45; 20 0.75,-3.45; 21 1.25,-3.45; 22 1.75,-3.45; 23 2.25,-3.45; 24 2.75,-3.45; 37 2.75,3.45; 38 2.25,3.45; 39 1.75,3.45; 40 1.25,3.45; 41 0.75,3.45; 42 0.25,3.45; 43 -0.25,3.45; 44 -0.75,3.45; 45 -1.25,3.45; 46 -1.75,3.45; 47 -2.25,3.45; 48 -2.75,3.45 | smd 5.7 x 5.7: 49 0,0
SOP50P490X110-10N = smd 1.47 x 0.28: 1 -2.15,1; 2 -2.15,0.5; 3 -2.15,0; 4 -2.15,-0.5; 5 -2.15,-1; 6 2.15,-1; 7 2.15,-0.5; 8 2.15,0; 9 2.15,0.5; 10 2.15,1
SOIC8 = smd 1.549 x 0.61: 1 -2.7,1.905; 2 -2.7,0.635; 3 -2.7,-0.635; 4 -2.7,-1.905; 5 2.7,-1.905; 6 2.7,-0.635; 7 2.7,0.635; 8 2.7,1.905
MSOP-8_MS = smd 1.397 x 0.432: 1 -2.21,0.975; 2 -2.21,0.325; 3 -2.21,-0.325; 4 -2.21,-0.975; 5 2.21,-0.975; 6 2.21,-0.325; 7 2.21,0.325; 8 2.21,0.975
UDFN-4L_STM-L = smd 0.762 x 0.254: 1 -0.495,0.279; 2 -0.495,-0.279; 3 0.495,-0.279; 4 0.495,0.279
M2.5MOUNT = drill 2.6: P$1 0,0

### Placement (x,y rotation side)
C1  8.8,7 90 top
C2  16.2,44.8 0 top
C3  15.8,47 0 top
C4  7,46.4 270 top
C5  28.8,6.8 0 top
C6  42.3,10.7 0 top
C7  32.8,18.7 90 top
C8  34.25,19.1 90 top
C9  35.6,19.1 90 top
C10  27.45,14.6 90 top
C11  29.8,10.8 180 top
C12  29.4,36.7 0 top
C13  46.2,39.1 270 top
C14  32.35,36.7 180 top
C15  71.6,4.8 270 top
C16  60.2,7.6 270 top
C17  37.8,25.95 180 top
C18  30.8,15.75 90 top
C19  37.3,18.7 90 top
C20  34.87,25.71 0 top
C21  21.9,10.3 180 top
C22  35.4,22.4 180 top
C23  41.11,19.11 90 top
CAN1  3.4,14 90 top
CAN2  12,14 90 top
D1  25.2,18.6 0 top
D2  55,47.4 180 top
D3  29.75,29.77 270 top
D4  42.2,13.9 0 top
D5  42.4,9.1 0 top
D6  42.6,44.2 90 top
D7  42.6,26.2 270 top
D8  68,4 0 top
D9  23.95,45.41 0 top
DB_3  19,18.4 0 top
DB_FLT  39.8,20.25 0 top
DB_G  16.6,18.4 0 top
DB_IAMP  30.39,13.1 0 top
DB_IB  39.4,17.95 0 top
DB_IBUF  29.61,14.15 0 top
DB_IS  33.55,22.15 0 top
DB_LEN  40.2,40.4 0 top
DB_TEMP  41,21.6 90 top
DB_TIMER  31,19 0 top
DB_VIN  19.25,46.6 0 top
DB_VSW  68,46 0 top
J1  22.4,2.6 180 top
J2  35,47.4 0 top
J3  36.6,2.6 180 top
L1  9.8,46.4 270 top
P1  68,37 90 top
P2  68,25 90 top
P3  68,13 90 top
P4  76,37 90 top
P5  76,25 90 top
P6  76,13 90 top
P7  23.4,31 90 top
Q1  55.8,27.2 90 top
Q2  55.8,14.4 90 top
Q3  55.8,40 90 top
Q4  45.2,44.8 270 top
Q5  42.1,37.8 270 top
R1  7.2,7 90 top
R2  11.4,49 0 top
R3  29.8,40.2 180 top
R4  37,33.2 0 top
R5  45.4,36.65 0 top
R6  44.6,39.1 270 top
R7  32.35,38.3 0 top
R8  29.4,38.3 0 top
R9  42.1,12.3 180 top
R10  43.9,7.4 0 top
R11  31.2,24 90 top
R12  28.8,23.6 0 top
R13  46.05,11.6 270 top
R14  44.55,11.6 90 top
R15  29.6,42 180 top
R16  43.2,15.8 180 top
R17  43,47.6 180 top
R18  46,47.6 0 top
R19  42.35,40.45 0 top
R20  49,48.2 180 top
R21  42.8,22.8 0 top
R22  49,46.6 180 top
R23  45.45,14.55 270 top
R24  34.2,28 90 top
R25  35.4,23.8 180 top
R26  41,16.2 90 top
SH1  18.6,27.2 180 top
U1  12.8,46.4 180 top
U2  35.4,13.2 180 top
U3  37,37.6 0 top
U4  21.9,13.9 180 top
U5  37.8,28.4 180 top
U6  58.4,8.4 0 top
U$1  77,47 0 top
U$2  3,47 0 top
U$3  3,3 0 top
U$4  77,3 0 top

### Tracks (layer width: path | path; a pad name or v marks a point on that pad's centre or on a via)
3V3_EN
  Top 0.152: U1.2 15.55,46.15 15.6,46.2 15.6,48.8 15.8,49 | 15.93,49.13 15.8,49 | R2.P$2 15.8,49
  Top 0.254: 11.8,44.8 12,45 12.4,45 12.8,45.4 12.8,45.8 13.15,46.15 U1.2
  Top 0.305: D1.CATHODE 22.12,18.6 10,30.73 10,43.8 10.8,43.8 11.8,44.8
  Top 0.406: D2.CATHODE 53.78,49.17 15.93,49.13
3V3_OVERRIDE
  Top 0.152: U2.26 31.42,15.45 31.3,15.57 30,15.57 29.63,15.94 29.06,15.94 28.6,16.4 28.6,17.6 27.6,18.6 D1.ANODE
+24V  (via drill 0.5)
  Top 0.152: v31,31.2 31.8,30.4 31.8,25.35 R11.P$2
  Top 0.254: DB_VIN.P$1 19.25,44.43 P7.2
  Top 0.305: v31,35.4 29.15,35.4 28.65,35.9 C12.P$1 27.93,37.42 27.93,39.08 R3.P$2 29.65,40.8 29.65,44.05 31,45.4 31,48 31.4,48.4 37.2,48.4 38,47.6 J2.4
  Top 0.813: C2.P$1 15.25,44.35 21,38.6 23.05,38.6 P7.2
  other vias: 32.2,34.6 31,34 32.2,33.2 31,32.6 32.2,31.8
  pour Top (no thermals): 13.4,45.7 14.9,45.7 15.2,45.4 15.8,45.4 15.8,44 14.2,44 13.4,44.8
  pour Top (isolate 0.5, rank 2, no thermals): 19.8,45.8 21.2,45.8 27.4,39.6 27.4,36.6 28.2,35.8 33.2,35.8 33.8,35.2 33.8,30.4 26.8,30.4 25.4,31.8 22.6,31.8 19.8,34.6
  pour Route2 (isolate 0.5, rank 2, no thermals): 19.8,41.4 24.8,41.4 26.4,39.8 26.4,37.6 28.2,35.8 33.2,35.8 33.8,35.2 33.8,30.4 26.8,30.4 25.4,31.8 22.6,31.8 19.8,34.6
  pour Route15 (isolate 0.5, rank 2, no thermals): 19.8,41.4 24.8,41.4 26.4,39.8 26.4,37.6 28.2,35.8 33.2,35.8 33.8,35.2 33.8,30.4 26.8,30.4 25.4,31.8 22.6,31.8 19.8,34.6
  pour Bottom (isolate 0.5, rank 2, no thermals): 19.8,41.4 24.8,41.4 26.4,39.8 26.4,37.6 28.2,35.8 33.2,35.8 33.8,35.2 33.8,30.4 26.8,30.4 25.4,31.8 22.6,31.8 19.8,34.6
CAN_N
  Top 0.254: CAN1.2 CAN2.2 14.61,14.13 18.8,14.13 U4.6
CAN_P
  Top 0.254: CAN1.1 CAN2.1 14.56,12.06 17.2,12.06 18.4,13.27 U4.7
CAN_RX
  Top 0.152: U2.33 29.25,11.95 28.5,12.7 28.5,14.9 25.64,14.9 24.73,15.8 U4.4
CAN_SHDN
  Top 0.152: U2.32 31.83,12.33 29.37,12.33 28.84,12.85 28.84,15.16 28.73,15.27 26.45,15.27 26,15.73 26,16.14 25.33,16.6 20,16.6 U4.5
CAN_TX
  Top 0.152: U4.1
  Top 0.254: U2.34 31.05,11.45 30.97,11.53 25.07,11.53 U4.1
FET_TEMP
  Top 0.152: U6.1 56.4,8.68 56.14,8.42 46.95,8.42 46.82,8.55 46.82,12.95 44.6,12.95 44.6,14.89 44.39,15.1 43.41,15.1 43.41,17.89 42.09,19.31 42.05,19.31 | 42.05,19.31 38.6,19.31 37.78,18.48 36.66,18.48 36.62,18.45 36.62,17.45 36.65,17.43 U2.16 | DB_TEMP.P$1 41.8,20.8 41.8,19.56 42.05,19.31
FLT  (via drill 0.3)
  Top 0.152: U3.6 38.2,35.65 v38.2,35.4 | v38.2,31.2 38.2,30.6 38.8,30 40.7,30 41.53,29.17 41.53,26.93 39.8,25.2 DB_FLT.P$1 | U2.13 38.15,17.2 v38.45,17.5
  Top 0.305: DB_FLT.P$1 39.8,21.6 41,22.8 R21.P$1
  Bottom 0.152: v38.2,35.4 v38.2,31.2 | v38.45,17.5 38.63,17.5 38.94,17.2 40.15,17.2 40.15,18.7 39.8,19.05 DB_FLT.P$1
GATE  (via drill 0.3)
  Top 0.406: Q3.1 57.46,37.46 56.8,36.8 | 56.8,36.8 56.8,24.6 | 56.8,24.6 62.59,24.6 Q1.1 | Q2.1 57.34,11.86 56.8,12.4 56.8,24.6 | 56.8,36.8 v56.5,36.8 | v46.15,37.55 R5.P$2
  Bottom 0.406: v56.5,36.8 46.9,36.8 v46.15,37.55
GDRV
  Top 0.305: R5.P$1 44.65,38.3 R6.P$2 43.85,37.6 U3.8
GND  (via drill 0.3, 0.5)
  Top 0.152: v9.85,49 R2.P$1 | U2.38 33.15,11.15 v33.4,11.4
  Top 0.254: U1.7 12.25,46.15 12.8,46.7 v12.8,47.8 | U4.2 23.36,13.27 v23.3,13.2 | J3.5 32.67,5.07 | CAN2.3 v9.8,16 CAN1.3 | C21.P$2 20.4,10.3 v20.3,10.4 19.2,11.5 U4.8 | v8.8,9.1 C1.P$2 R1.P$2 | U6.3 60.17,6.85 C16.P$2 v53.25,6.85 | v44.2,9.6 44.15,9.6 C6.P$2
  Top 0.305: C7.P$2 v32.8,20.2 | C9.P$2 v35.6,20.6 | v34.2,20.6 34.25,20.55 C8.P$2 | R12.P$1 v28.75,23.6 | C19.P$2 37.3,20.1 v37.2,20.2 | C11.P$2 v29.05,9.9 | v21.65,2 J1.4 | v32.7,1.95 32.7,5.04 32.67,5.07 | C6.P$2 v42.35,10.7 | R14.P$1 44.55,11.5 v44.6,11.55 | C18.P$2 v30.8,17.3 | v33.1,46.95 33.1,45.76 J2.2 | v29.45,36.7 C12.P$2 | v29.35,38.3 R8.P$1 | v30.85,36.7 C14.P$2 | v34.85,36 U3.5 | Q5.P$3 42.15,36.85 v43.05,36.85 | v46.2,39.05 C13.P$2 | R19.P$1 v42.3,40.45 | Q4.P$2 44.3,45.85 v45.1,45.85 | v28.85,6.8 C5.P$2 | C20.P$2 v36.29,25.71 | C23.P$2 41.11,20.52 v41.2,20.61 | R20.P$1 49.8,48.25 v50.5,48.25 | R22.P$1 49.8,46.65 v50.5,46.65
  Top 0.406: U5.4 38.5,29.38 v38.5,29.35
  Route2 0.254: v53.25,6.85 46.95,6.85 v44.2,9.6
  other vias: 18.1,45.2 17.8,46.4 17.8,47.6 18.1,44 7,43.8 8,43.8 6,43.8 33.4,15 35.4,15 37.3,15 35.4,13.2 37.3,13.2 37.3,11.4 35.4,11.4 26.9,17 27.7,17 16.9,27.6 16.9,26.8
  pour Top (no thermals): 16.8,44 16.8,45.6 16.2,46.2 16.2,48.2 18.7,48.2 18.7,43.4 17.4,43.4
  pour Top (no thermals): 26.6,17.4 28.2,17.4 28.2,15.6 26.6,15.6
  pour Top (no thermals): 16.6,28 17.6,28 17.6,26.4 16.4,26.4 16.4,28
  pour Route2 (isolate 0.2, rank 3, no thermals): 0.6,47.6 2.4,49.4 46.6,49.4 46.6,0.8 46.8,0.6 2.2,0.6 0.6,2.2
  pour Route2 (no thermals): 44.4,49.4 55.8,49.4 55.8,46 45,46 45,48.8
  pour Top (no thermals): 5.4,43.2 5.4,44.6 6,45.2 7.6,45.2 8.8,44 8.8,43.2
GPIO1
  Top 0.152: U2.39 33.65,8.95 34.6,8 J3.4
GPIO2
  Top 0.152: U2.40 34.15,9.05 34.6,8.6 36.2,8.6 36.6,8.2 J3.3
GPIO3
  Top 0.152: J3.2 38.5,5.25 38.6,5.35 38.6,7.6 37.2,9 35,9 34.65,9.35 U2.41
ISAMP
  Top 0.152: U2.17 36.15,17.15 36.32,17.32 36.32,17.33 36.32,21.2 35.85,21.2 C22.P$2
  Top 0.254: DB_IS.P$1 33.55,24.4 33.26,24.69 33.26,29.38 U5.5
  Top 0.305: DB_IS.P$1 33.8,22.4 C22.P$2 R25.P$2
ISAMP_AMP
  Top 0.152: U2.30 30.74,13.45 DB_IAMP.P$1
ISAMP_BIAS  (via drill 0.3)
  Top 0.254: v38.4,19.8 38.4,21.8 36.8,23.4 36.8,23.8 36.8,24.4 36.4,24.8 35,24.8 34.12,25.68 C20.P$1 | U2.12 38.8,16 38.8,16.3 39.4,16.9 DB_IB.P$1
  Top 0.305: C20.P$1 34.2,25.79 R24.P$1 | C22.P$1 R25.P$1 36.8,23.8 | DB_IB.P$1 40.4,16.95 R26.P$2
  Bottom 0.254: v38.4,19.8 38.4,18.95 DB_IB.P$1
ISAMP_BUF  (via drill 0.35)
  Top 0.152: U2.18 35.65,17.43 v35.6,17.47 | U2.28 31.3,14.45 31,14.15 DB_IBUF.P$1
  Bottom 0.152: v35.6,17.47 33.76,15.63 33.14,15.63 31.66,14.15 DB_IBUF.P$1
LED1
  Top 0.305: U2.8 41.4,13.95 D4.CATHODE
LED2
  Top 0.152: U2.47 37.65,9.15 38,8.8 41.35,8.8 D5.CATHODE
LTC_EN
  Top 0.305: R3.P$1 31.7,39.05 33.53,39.05 33.98,38.6 U3.1 37.05,38.6 37.51,39.06 38.86,39.06 DB_LEN.P$1 40.2,39.75 Q5.P$2
N$1
  pour Top (no thermals): 8.6,46 11.2,46 11.5,45.7 12.1,45.7 12.1,45.6 11.6,45.6 11.1,45.1 8.6,45.1
N$2
  Top 0.254: J2.1 30.35,43.2 R15.P$1
N$3
  Top 0.305: R24.P$2 35.56,28.75 U5.6
N$4
  Top 0.254: U1.3 14.7,46.65 C3.P$1
N$5
  Top 0.152: 39.73,15.68 40.02,15.97 40.45,16.4 41.6,16.4 41.6,16.48 41.68,16.55 41.68,17.79 C23.P$1
  Top 0.203: U2.11 39.5,15.45 39.73,15.68
N$6
  Top 0.305: C17.P$1 38.55,25.96 U5.1
N$7
  Top 0.305: U5.8 37.05,25.96 C17.P$2
N$8
  Top 0.305: R9.P$1 42.95,12.4 D4.ANODE
N$9
  Top 0.305: R6.P$1 C13.P$1
N$10
  Top 0.152: U2.9 40,14.45 R26.P$1
N$11
  Top 0.305: R18.P$1 45.2,46.75 Q4.P$1 46.95,46.6 R22.P$2
N$13  (via drill 0.3, 0.35)
  Top 0.152: v42.2,38.8 42.25,38.85 43.1,38.85 | D7.CATHODE 42.41,27.88 42,29.2 40.49,30.7 39.49,30.7 v39.4,30.8
  Top 0.305: D6.CATHODE 43.1,42.02 R19.P$2 43.1,38.85 Q5.P$1
  Bottom 0.152: v39.4,30.8 39.4,31.3 39.38,31.32 39.3,31.41 39.29,31.41 39.3,31.54 39.3,35.9 v42.2,38.8
N$14
  Top 0.305: D5.ANODE R10.P$1
N$15
  Top 0.254: C1.P$1 R1.P$1 3.95,3 U$3.P$1
N$17
  Top 0.305: R17.P$1 42.6,46.65 D6.ANODE
N$18
  Top 0.152: R16.P$1 43.94,17.91 42.2,19.65 42.2,21.88 42.58,22.25 42.58,23.58 42.6,23.6 D7.ANODE
NRST  (via drill 0.3)
  Top 0.152: J1.2 24.6,4.55 24.6,5.82 25.98,7.2 27.65,7.2 C5.P$1 30.05,8.8 v31.8,8.8 | U2.7 38.9,13.4 40,13.4 40.2,13.2 v40.2,12
  Bottom 0.152: v40.2,12 39.92,11.72 39.92,9.92 38.8,8.8 v31.8,8.8
PGND  (via drill 0.5)
  other vias: 65,2 65,0.8 65,3.2 70.8,1.8 70.8,0.8 72.2,0.8 72.2,1.8 29.6,26.2 28.4,26.2 27.2,26.2 26.8,27.6 26.8,29 25.6,46.6 25.6,45.4 25.6,44.2 25.6,43 26.8,43
  pour Top (isolate 0.5, no thermals): 64.6,3.8 70.86,3.8 71,4 72.8,4 72.8,0.4 64.6,0.4
  pour Top (isolate 0.5, no thermals): 18.8,30 31.36,30.04 31.4,26.2 30.4,25.2 30.4,24.6 26.8,24.6 24.6,22.4 21.2,22.4 20.8,22.8 18.8,24.6
  pour Route15 (isolate 0.5, no thermals): 19.8,31.4 24.8,31.4 26.2,30 43.8,30 59,45.2 73.2,45.2 75.4,43 79.4,43 79.4,6 75,6 73,0.4 60.6,0.4 42,19 19.8,19
  pour Bottom (isolate 0.5, no thermals): 19.8,31.4 24.8,31.4 26.2,30 43.8,30 59,45.2 73.2,45.2 75.4,43 79.4,43 79.4,6 75,6 73,0.4 60.6,0.4 42,19 19.8,19
  pour Top (no thermals): 24.8,47.2 27.6,47.2 27.6,42.4 25.6,42.4 24.8,43.2
  pour Route15 (isolate 0.5, no thermals): 19,24.4 15.2,28.2 15.2,47.4 15.6,47.8 28.2,47.8 28,47.6 28,41.4 19.4,41.4 19.4,34.4 22.4,31.4 24.8,31.4 26.6,29.6 26.6,22.4 21.2,22.4 20.4,23.2
PROG
  Top 0.305: R8.P$2 R7.P$1 32.35,37.55 33.53,37.55 33.58,37.6 U3.3
PWR_LED  (via drill 0.35)
  Top 0.152: U2.25 30.05,15.95 29.76,16.25 29.55,16.25 28.91,16.89 28.91,17.73 28.8,17.83 28.8,18.6 27.6,19.8 22.4,19.8 15.4,26.8 15.4,39 v17.2,40.8 | v22.6,47 23.4,47.8 28.25,47.8 28.25,42.6 R15.P$2
  Bottom 0.152: v17.2,40.8 17.2,42.8 17.77,43.37 18.36,43.37 18.6,43.4 19,43.8 19,45 20.6,46.6 22.2,46.6 v22.6,47
PWR_OVERRIDE
  Top 0.152: R16.P$2 42.45,14.52 42.32,14.39 42.32,13.65 41.65,12.98 40.95,12.98 40.82,12.85 40.82,11.63 40.65,11.45 U2.3
PWR_SW
  Top 0.305: J2.3 35.99,40.8 39.03,40.8 41.51,43.28 41.51,46.85 R17.P$2 42.57,47.6 43.32,48.35 45.68,48.35 46.43,47.6 R18.P$2 47.35,48.2 R20.P$2 49.05,47.4 D2.ANODE
SNS_PWR_SW  (via drill 0.3)
  Top 0.152: U2.10 38.93,14.87 39.57,14.87 40.32,15.62 40.32,15.85 40.48,16 41.8,16 41.92,16.12 41.92,16.34 42.4,16.82 v42.4,17.4 | v42.96,29.14 43,29.09 43,29 43.6,28.2 43.6,24 43.08,23.48 43.01,23.48 43,20.4 43,20 43.2,19.8 v43.2,19.6 | v43.86,40.8 45.2,42.14 Q4.P$3
  Top 0.254: R23.P$1 45.45,17.43 45.38,17.42 v43.2,19.6
  Bottom 0.152: v42.4,17.4 42.4,18.8 v43.2,19.6 | v42.96,29.14 42.86,29.14 41.2,30.8 39.6,32.8 39.6,35.4 42.2,38 43.6,38 43.86,38.26 v43.86,40.8
SWCLK
  Top 0.152: U2.37 31.75,9.75 31.11,9.11 29.92,9.11 28.62,7.8 21,7.8 20.15,6.95 J1.5
SWDIO  (via drill 0.3)
  Top 0.152: U2.36 31.75,10.5 31.7,10.5 30.61,9.41 29.41,9.41 28.4,8.4 v23.8,8.4 | v23.2,7.2 23.2,4.65 J1.3
  Bottom 0.152: v23.8,8.4 23.2,7.8 v23.2,7.2
TIMER  (via drill 0.3)
  Top 0.152: 32.65,16.88 U2.24 | DB_TIMER.P$1 31.62,19 32.02,18.6
  Top 0.305: U3.4 33.73,37.1 33.72,37.09 33.49,37.09 C14.P$1 33.8,36 34,36 34.24,35.76 34.24,35.75 34.6,35.39 35.1,35.39 35.11,35.4 v36,35.4 | v35.6,30.8 35.2,30.8 34.3,29.9 32.59,29.9 32.59,20.95 32.02,20.38 32.02,18.6 32.02,17.5 32.65,16.88
  Bottom 0.305: v35.6,30.8 36,31.2 v36,35.4
VCC  (via drill 0.3, 0.5)
  Top 0.254: U1.4 13.75,47.55 13.8,47.6 v13.8,48.2 | U4.3 23.34,14.54 v23.3,14.5 | C21.P$1 v21.95,10.3 | U6.4 59.87,8.68 C16.P$1 60.25,8.3 v60.25,7.7
  Top 0.305: v32.8,18.65 C7.P$1 33.15,17.6 U2.23 | v34.2,18.65 34.25,18.6 C8.P$1 34.15,18.25 U2.21 | v35.6,18.65 C9.P$1 35.6,18.11 35.1,18.1 35.1,18.01 34.65,17.56 U2.20 | v29.85,10.8 C11.P$1 30.7,10.95 U2.35 | v18.65,2.05 J1.6 | v40.6,1.9 J3.1 | C6.P$1 40.65,10.7 v40.45,10.5 40.4,10.45 U2.1 U2.48 | v42.05,12.3 R9.P$2 | v45.45,14.5 R23.P$2 45.45,14.05 46.4,15 46.4,19.95 R21.P$2 | v43.94,7.4 R10.P$2
  Route2 0.254: v60.25,7.7 47.1,7.7 v45.4,9.4
  other vias: 6,49 7,49 8,49 27,14.2 27.8,14.2
  pour Top (no thermals): 26.6,14.6 28.2,14.6 28.2,12.8 26.6,12.8
  pour Route15 (isolate 0.2, rank 3, no thermals): 0.6,47.6 2.4,49.4 46.6,49.4 46.6,0.6 2.2,0.6 0.6,2.2
  pour Top (no thermals): 5.4,49.6 8,49.6 9.6,48 11,48 11,47.2 6.6,47.2 5.4,48.4
VIN_SAMP  (via drill 0.35)
  Top 0.152: C18.P$1 30.85,14.95 U2.27 | R12.P$2 29.9,23.25 R11.P$1
  Top 0.254: 30.06,23.09 R12.P$2
  Top 0.305: v29.43,15.2 29.45,15.17 30.4,15.17 30.57,15 C18.P$1 | v29.6,17.8 29.6,22.64 30.06,23.09
  Bottom 0.305: v29.43,15.2 29.43,17.63 v29.6,17.8
VREF
  Top 0.305: R7.P$2 33.3,38.1 U3.2
VSENSE  (via drill 0.5)
  Top 0.152: 51.95,40 Q3.2
  other vias: 41.4,34.6 41.4,33.2 41.4,31.8 42.8,32.4 42.8,34 44.2,34.6 44.2,33.2 44.2,31.8 47.8,33.6 49,33.6 50.2,33.6 51.4,33.6 52.6,33.6 53.8,33.6 55,33.6 47.8,20.8 49,20.8 50.2,20.8 51.4,20.8 52.6,20.8 53.8,20.8 55,20.8
  pour Top (isolate 0.5, no thermals): 40.4,30.8 40.4,35.2 40.8,35.6 47.4,35.6 47.4,45.6 55.8,45.6 55.8,9 56,8.8 47.2,8.8 47.2,25.8 42.2,30.8
  pour Route2 (isolate 0.5, no thermals): 40.8,35.6 47.4,35.6 47.4,45.6 55.8,45.6 55.8,9 47.2,9 47.2,25.8 42.2,30.8 40.4,30.8 40.4,35.2
VSENSE_HIGH
  Top 0.305: U5.7 36.67,28.07 36.9,28.3 36.9,32.3 R4.3 36.8,34 36.8,37.7 37.7,38.6 U3.10
VSENSE_LOW
  Top 0.305: U5.2 37.92,28.07 37.5,28.5 37.5,32.7 R4.4 37.3,33.9 37.3,37.4 38,38.1 U3.9
VSWITCHED  (via drill 0.3, 0.5)
  Top 0.305: R13.P$2 46.15,10.76 46.15,8.32 48.47,6 61.8,6 v63.8,8 | v59,33.6 57.6,35 v57.6,35.8 | v41.25,36.15 40.3,37.1 U3.7
  Top 0.406: DB_VSW.P$1 66.4,44.4 v63,44.4
  Bottom 0.305: v57.6,35.8 57.25,36.15 v41.25,36.15
  other vias: 59,20.8 60.2,20.8 61.4,20.8 62.6,20.8 63.8,20.8 60.2,33.6 61.4,33.6 62.6,33.6 63.8,33.6 64,15.2 62.6,15.2 61.2,15.2 64,18.8 62.6,18.8 61.2,18.8 61.4,40.8 63,40.8 61.2,31.6 62.6,31.6 64,31.6 61.1,28 62.6,28 64,28
  pour Top (isolate 0.5, no thermals): 58.4,45.2 73.2,45.2 75.4,43 79.4,43 79.4,6 73.6,6 72.8,5.2 65.2,5.2 58.4,12
  pour Route2 (isolate 0.5, no thermals): 58.4,45.2 73.2,45.2 75.4,43 79.4,43 79.4,6 73.6,6 72.8,5.2 65.2,5.2 58.4,12
VSWITCHED_SAMP
  Top 0.254: R14.P$2 44.18,12.72 44.19,14.73 43.03,14.73 43.03,17.69 43.01,17.71 41.95,18.94 38.74,18.94 37.75,17.95 C19.P$1
  Top 0.305: R13.P$1 R14.P$2 | C19.P$1 37.15,17.8 U2.15

### Text on the board
tPlace: VSW | VIN | L+ | L- | SP | SG | G | 3V | G | 1 | 2 | 3 | 3V | power dist r4.2 | (c) 2020
tNames: EN | IS | TEMP | FLT | TIM